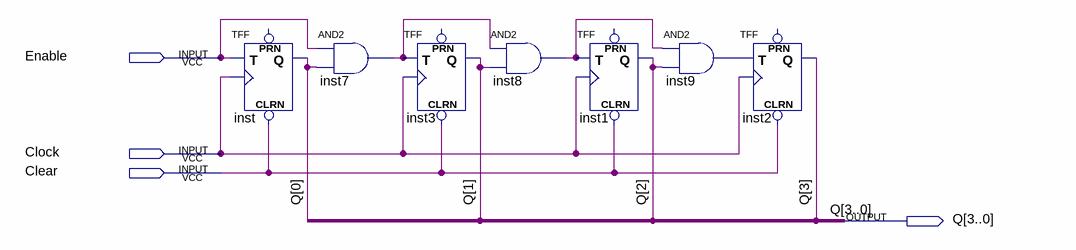
[diagram p0: schematic sheet]
// Quartus schematic BODEM4BIT.bdf as structural Verilog: 7 symbols, 4 pins
module BODEM4BIT (
  input  Enable,
  input  Clock,
  input  Clear,
  output [3:0] Q
);

  wire inst7_out, inst8_out, inst9_out;

  TFF inst (.CLRN(Clear), .T(Enable), .CLK(Clock), .Q(Q[0]));  // open: PRN
  and inst7 (inst7_out, Enable, Q[0]);
  TFF inst3 (.CLRN(Clear), .T(inst7_out), .CLK(Clock), .Q(Q[1]));  // open: PRN
  and inst8 (inst8_out, inst7_out, Q[1]);
  TFF inst1 (.CLRN(Clear), .T(inst8_out), .CLK(Clock), .Q(Q[2]));  // open: PRN
  and inst9 (inst9_out, inst8_out, Q[2]);
  TFF inst2 (.CLRN(Clear), .T(inst9_out), .CLK(Clock), .Q(Q[3]));  // open: PRN
endmodule
